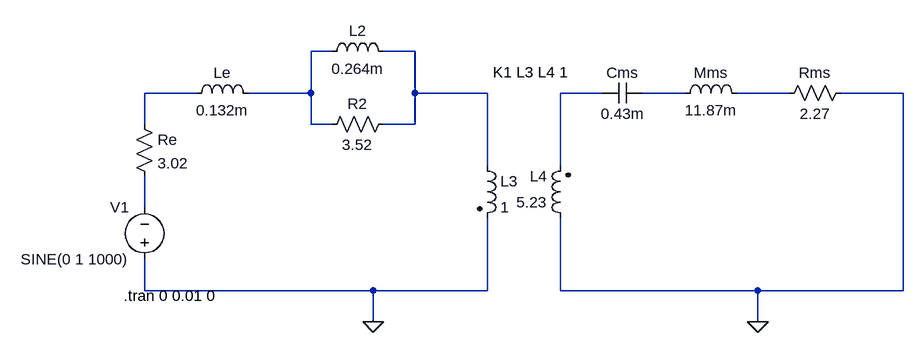
[diagram p0: schematic Klippel_Circuit.asc]
Klippel_Circuit.asc, the LTspice schematic file:
Version 4
SHEET 1 1172 680
WIRE 288 -224 256 -224
WIRE 416 -224 368 -224
WIRE 80 -160 0 -160
WIRE 256 -160 256 -224
WIRE 256 -160 160 -160
WIRE 416 -160 416 -224
WIRE 528 -160 416 -160
WIRE 704 -160 640 -160
WIRE 832 -160 768 -160
WIRE 992 -160 912 -160
WIRE 1168 -160 1072 -160
WIRE 0 -112 0 -160
WIRE 256 -112 256 -160
WIRE 288 -112 256 -112
WIRE 416 -112 416 -160
WIRE 416 -112 368 -112
WIRE 528 -48 528 -160
WIRE 640 -48 640 -160
WIRE 0 16 0 -32
WIRE 0 144 0 96
WIRE 352 144 0 144
WIRE 528 144 528 32
WIRE 528 144 352 144
WIRE 640 144 640 32
WIRE 944 144 640 144
WIRE 1168 144 1168 -160
WIRE 1168 144 944 144
WIRE 352 192 352 144
WIRE 944 192 944 144
FLAG 944 192 0
FLAG 352 192 0
SYMBOL res -16 -128 R0
SYMATTR InstName Re
SYMATTR Value 3.02
SYMBOL ind 64 -144 R270
WINDOW 0 32 56 VTop 2
WINDOW 3 5 56 VBottom 2
SYMATTR InstName Le
SYMATTR Value 0.132m
SYMBOL ind 272 -208 R270
WINDOW 0 32 56 VTop 2
WINDOW 3 5 56 VBottom 2
SYMATTR InstName L2
SYMATTR Value 0.264m
SYMBOL res 272 -96 R270
WINDOW 0 32 56 VTop 2
WINDOW 3 0 56 VBottom 2
SYMATTR InstName R2
SYMATTR Value 3.52
SYMBOL ind2 512 -64 R0
SYMATTR InstName L3
SYMATTR Value 1
SYMATTR Type ind
SYMBOL ind2 656 48 R180
WINDOW 0 36 80 Left 2
WINDOW 3 36 40 Left 2
SYMATTR InstName L4
SYMATTR Value 5.23
SYMATTR Type ind
SYMBOL cap 768 -176 R90
WINDOW 0 0 32 VBottom 2
WINDOW 3 32 32 VTop 2
SYMATTR InstName Cms
SYMATTR Value 0.43m
SYMBOL ind 816 -144 R270
WINDOW 0 32 56 VTop 2
WINDOW 3 5 56 VBottom 2
SYMATTR InstName Mms
SYMATTR Value 11.87m
SYMBOL res 1088 -176 R90
WINDOW 0 0 56 VBottom 2
WINDOW 3 32 56 VTop 2
SYMATTR InstName Rms
SYMATTR Value 2.27
SYMBOL voltage 0 112 R180
WINDOW 0 24 96 Left 2
WINDOW 3 24 16 Left 2
WINDOW 123 0 0 Left 2
WINDOW 39 0 0 Left 2
SYMATTR InstName V1
SYMATTR Value SINE(0 1 1000)
TEXT 536 -192 Left 2 !K1 L3 L4 1
TEXT -32 152 Left 2 !.tran 0 0.01 0

The netlist it stands for:
* Klippel_Circuit.asc
Re N003 N007 3.02
Le N003 N001 0.132m
L2 N001 N002 0.264m
R2 N001 N002 3.52
L3 N002 0 1
L4 0 N004 5.23
Cms N005 N004 0.43m
L§Mms N005 N006 11.87m
Rms 0 N006 2.27
V1 0 N007 SINE(0 1 1000)
K1 L3 L4 1
.tran 0 0.01 0
.backanno
.end